# EasyEDA Pro project ProProject_Open Energy Box_2024-07-22.epro, board PCB1
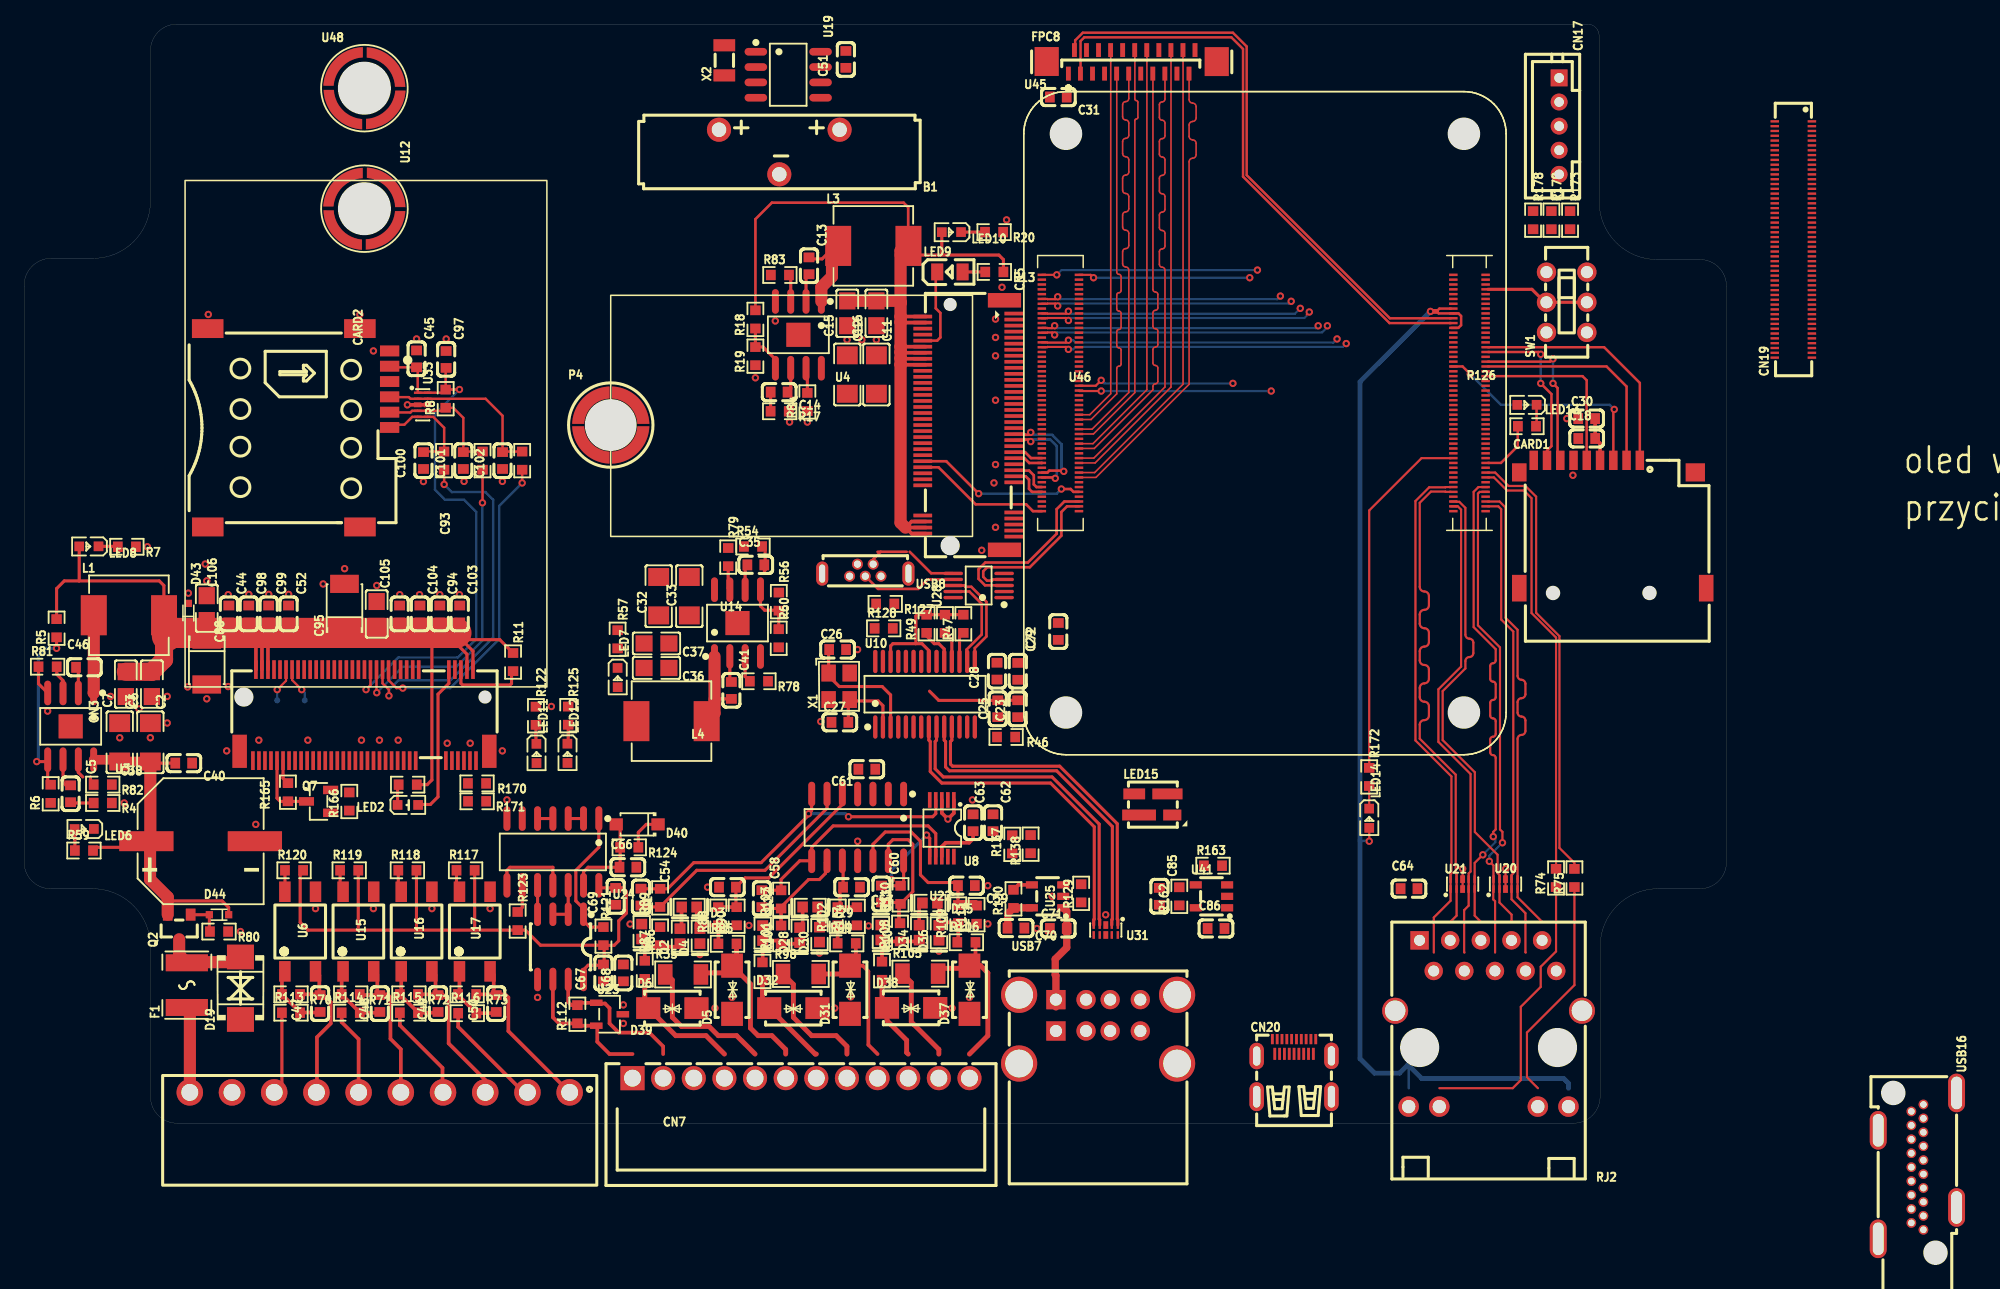
[diagram p12: board, top side]
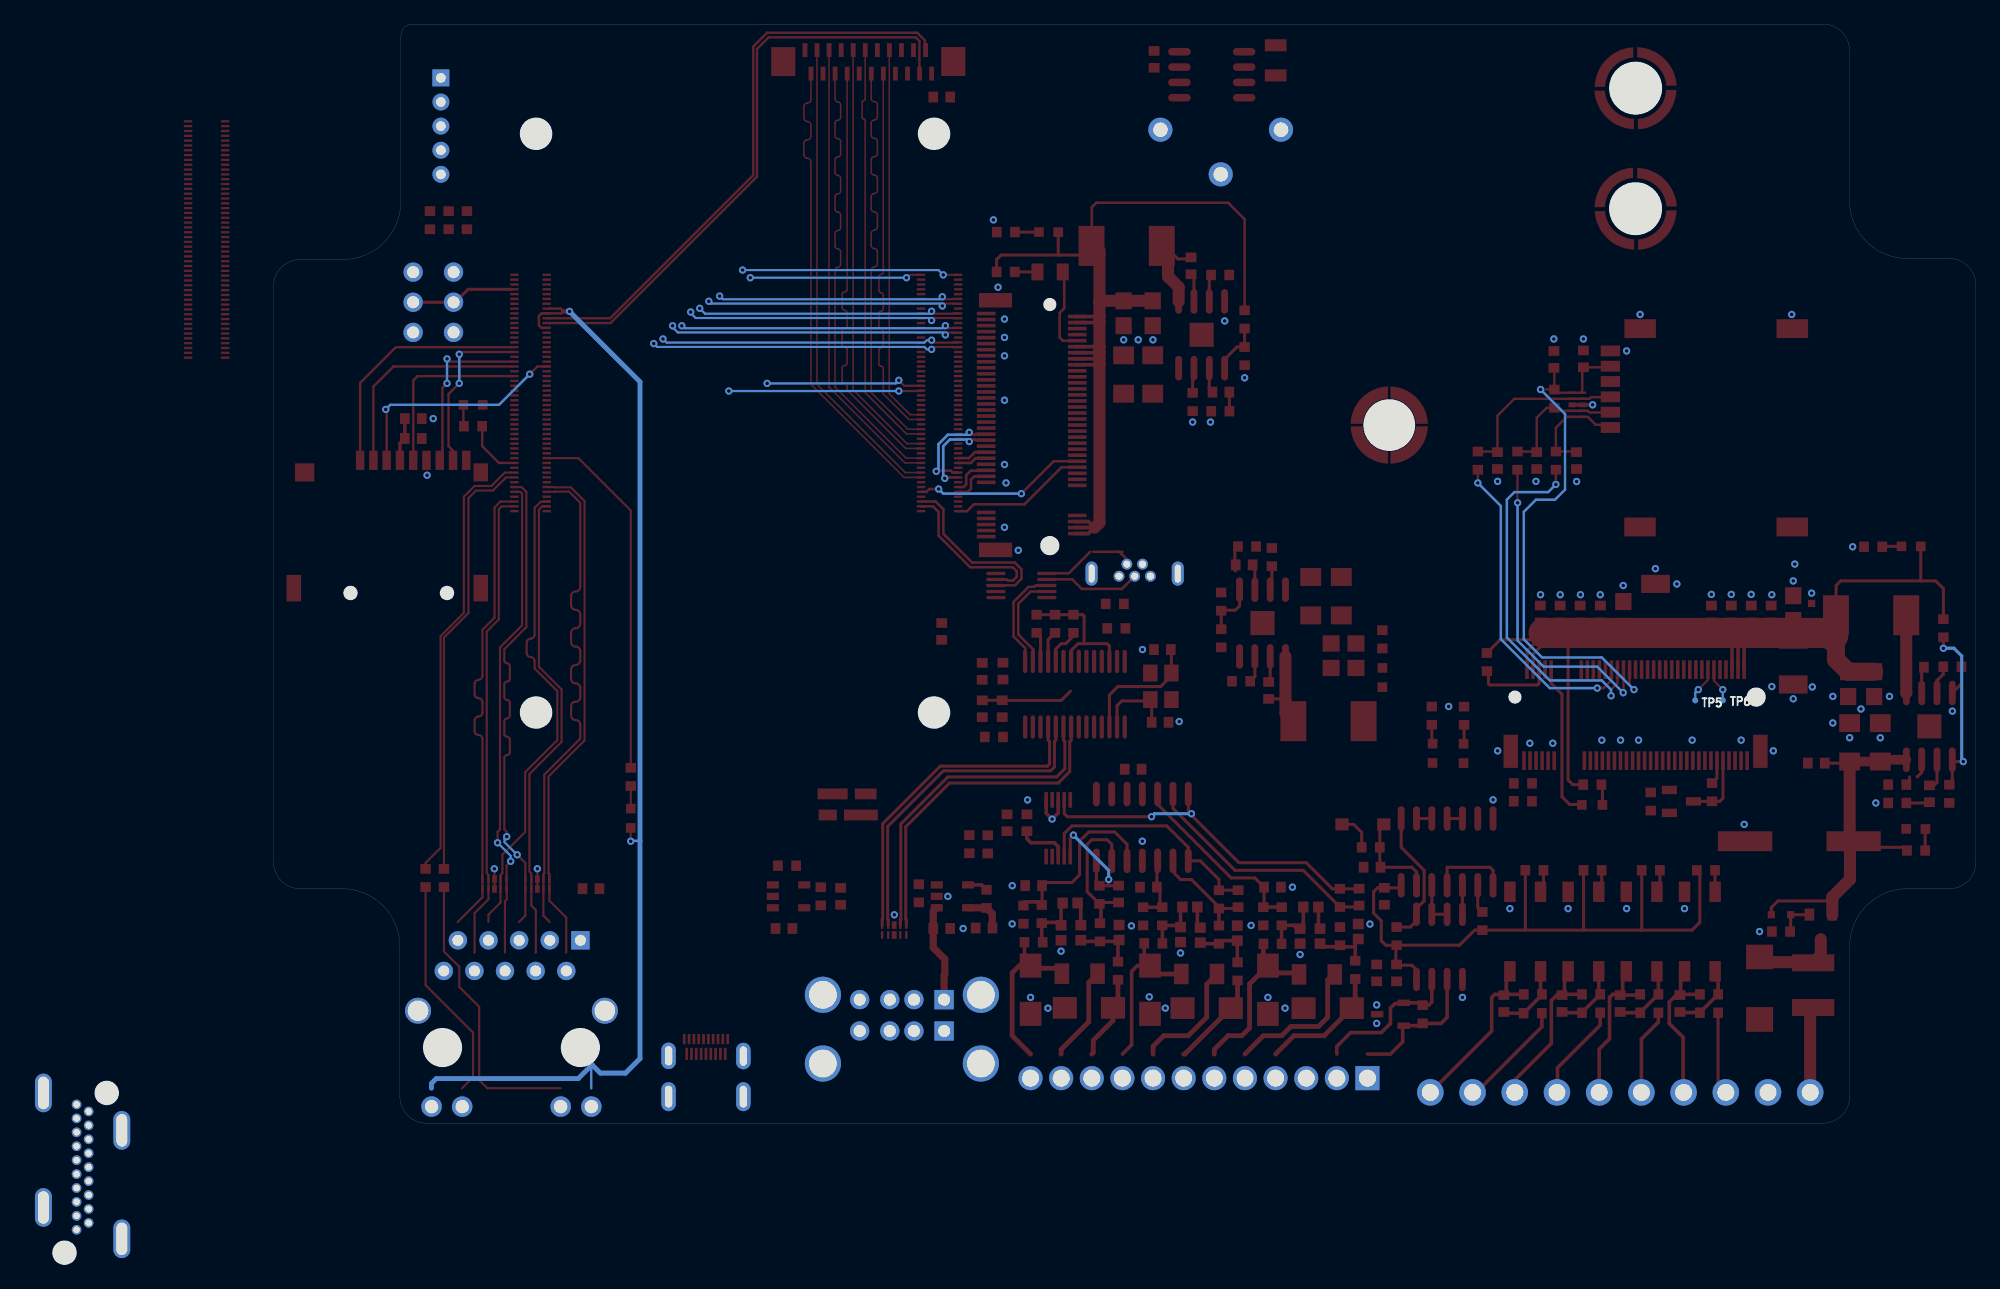
[diagram p13: board, bottom side, seen from below]

Outline 159.51 x 102.91 mm; copper layers: Top Layer, Inner1, Inner2, Bottom Layer. Coordinates in mm from the lower left corner of the outline.
Outline path: 0,81.18 0,33.4 arc(0.64,31.84) 2.2,31.2 5.68,31.2 arc(9.07,29.79) 10.48,26.4 10.48,13.95 arc(11.12,12.4) 12.68,11.75 128.49,11.75 arc(130.04,12.4) 130.69,13.95 130.69,26.4 arc(132.09,29.79) 135.49,31.2 138.96,31.2 arc(140.52,31.84) 141.16,33.4 141.16,81.18 arc(140.52,82.74) 138.96,83.38 135.41,83.38 arc(132.01,84.79) 130.61,88.18 130.61,101.95 arc(130.3,102.64) 129.6,102.91 12.68,102.91 arc(11.12,102.26) 10.48,100.71 10.48,88.18 arc(9.05,84.84) 5.68,83.48 2.2,83.48 arc(0.62,82.79) 0,81.18
Stack: Top Layer 0.035mm 外层铜厚1oz / Dielectric1 0.2104mm 7628 RC49% 8.6mil / Inner1 0.0152mm 内层铜厚 / Dielectric2 1.065mm 1.1mm H/HOZ 含铜 / Inner2 0.0152mm 内层铜厚 / Dielectric3 0.2104mm 7628 RC49% 8.6mil / Bottom Layer 0.035mm 外层铜厚1oz

## Design rules (mm)
net PCIE_CLP_P: PCIE_CLP
net PCIE_CLP_N: PCIE_CLP
net PCIE_R0_P: PCIE_R0_
net PCIE_R0_N: PCIE_R0_
net PCIE_T0_P: PCIE_T0_
net PCIE_T0_N: PCIE_T0_
net USB_GSM_P: USB_GSM_
net USB_GSM_N: USB_GSM_
net ETH_P1_P: DP1
net ETH_P1_N: DP1
net ETH_P0_N: ETH_P0_
net ETH_P0_P: ETH_P0_
net HDMI0_TX2_P: HDMI0_TX2_
net HDMI0_TX2_N: HDMI0_TX2_
net HDMI0_TX1_P: HDMI0_TX1_
net HDMI0_TX1_N: HDMI0_TX1_
net HDMI0_TX0_P: HDMI0_TX0_
net HDMI0_TX0_N: HDMI0_TX0_
net HDMI0_CLK_P: HDMI0_CLK_
net HDMI0_CLK_N: HDMI0_CLK_
net CAM1_D0_N: CAM1_D0_
net CAM1_D0_P: CAM1_D0_
net CAM1_D1_N: CAM1_D1_
net CAM1_D1_P: CAM1_D1_
net CAM1_C_N: CAM1_C_
net CAM1_C_P: CAM1_C_
net CAM1_D2_N: CAM1_D2_
net CAM1_D2_P: CAM1_D2_
net CAM1_D3_N: CAM1_D3_
net CAM1_D3_P: CAM1_D3_
net USB_N: USB_
net USB_P: USB_
net USB2_N: USB2_
net USB2_P: USB2_
net USB1_N: USB1_
net USB1_P: USB1_
net ETH_P3_P: ETH_P3_
net ETH_P3_N: ETH_P3_
net ETH_P2_N: ETH_P2_
net ETH_P2_P: ETH_P2_
net U_P: U_
net U_N: U_
net U2_P: U2_
net U2_N: U2_
template: Custom Config
spacing copperThickness1oz (default): track to track 0.102, other pairs 0.152 to 0.3
spacing copperThickness2oz: track to track 0.203, other pairs 0.152 to 0.3
track width copperThickness1oz (default): min 0.127, default 0.254, max 2.54
track width copperThickness2oz: min 0.203, default 0.254, max 2.54
differential pair differentialPair (default): width min 0.127, default 0.254, max 2.54; gap min 0.178, default 0.178
via viaSize (default): diameter min 0.5, default 0.61, max 10; hole min 0.3, default 0.305, max 6.299

## Placement (name value [footprint] x y rotation side)
B1  CR2032-BS-5-1  [BAT-TH_CR2032-BS-5-1]  62.62 92.3 180 top
C2  10uF  [C1206]  10.47 43.34 270 top
C3  10uF  [C1206]  7.93 43.34 270 top
C5  3.3nF  [C0603]  3.85 39.07 270 top
C6  22uF  [C0805]  10.59 48.17 90 top
C7  22uF  [C0805]  8.44 48.17 90 top
C11  10uF  [C1206]  70.67 73.85 270 top
C12  10uF  [C1206]  68.26 73.85 270 top
C13  100nF  [C0603]  65.08 82.86 270 top
C14  3.3nF  [C0603]  62.61 72.39 180 top
C15  22uF  [C0805]  68.26 78.93 90 top
C16  22uF  [C0805]  70.67 78.93 90 top
C18  100nF  [C0603]  129.57 68.54 0 top
C23  100nF  [C0603]  82.39 46.13 90 top
C25  10uF  [C0603]  80.74 46.13 90 top
C26  20pF  [C0603]  67.46 51.03 0 top
C27  20pF  [C0603]  67.65 45 0 top
C28  100nF  [C0603]  80.68 49.24 90 top
C29  10uF  [C0603]  82.4 49.23 270 top
C30  10uF  [C0603]  129.57 70.19 0 top
C31  100nF  [C0603]  85.76 96.86 180 top
C32  10uF  [C1206]  52.62 55.46 90 top
C33  10uF  [C1206]  55.16 55.46 90 top
C35  3.3nF  [C0603]  60.67 58.06 0 top
C36  22uF  [C0805]  52.44 49.51 180 top
C37  22uF  [C0805]  52.44 51.54 180 top
C38  220uF  [CAP-SMD_BD10.0-L10.3-W10.3-LS11.3-FD]  14.64 35.14 0 top
C40  100nF  [C0603]  13.23 41.62 180 top
C41  100nF  [C0603]  58.65 47.64 270 top
C44  33pF  [C0603]  16.98 53.99 270 top
C45  33pF  [C0603]  32.54 75.14 270 top
C46  100nF  [C0603]  5.01 49.56 0 top
C47  100nF  [C0603]  24.54 21.68 90 top
C48  100nF  [C0603]  29.5 21.68 90 top
C49  100nF  [C0603]  34.32 21.68 90 top
C50  100nF  [C0603]  39.15 21.68 90 top
C51  100nF  [C0603]  68.14 99.98 90 top
C52  100nF  [C0603]  21.93 53.99 270 top
C53  100nF  [C0603]  58.32 31.33 0 top
C54  100nF  [C0603]  51.15 30.51 270 top
C57  100nF  [C0603]  68.61 31.33 180 top
C58  100nF  [C0603]  61.18 30.38 270 top
C59  100nF  [C0603]  78.14 31.46 180 top
C60  100nF  [C0603]  71.09 30.76 270 top
C61  100nF  [C0603]  69.88 41.11 0 top
C62  100nF  [C0603]  80.34 36.67 270 top
C63  10uF  [C0603]  78.69 36.67 270 top
C64  10nF  [C0603]  114.84 31.2 0 top
C66  33pF  [C0603]  50.07 32.98 0 top
C67  100nF  [C0603]  48.04 24.22 90 top
C68  10uF  [C0603]  49.69 24.22 90 top
C69  100nF  [C0603]  49.05 30.57 90 top
C70  10uF  [C0603]  82.24 27.94 180 top
C71  10uF  [C0603]  85.76 27.9 0 top
C72  100nF  [C0603]  85.76 52.54 90 top
C85  10uF  [C0603]  94.14 30.57 270 top
C86  10uF  [C0603]  98.84 27.9 0 top
C88  220uF  [CASE-B_3528]  15.14 50 270 top
C93  33pF  [C0603]  31.14 53.99 270 top
C94  100nF  [C0603]  34.47 53.99 270 top
C95  220uF  [CASE-B_3528]  26.57 54.62 90 top
C97  220nF  [C0603]  34.99 75.1 270 top
C98  10pF  [C0603]  18.63 53.99 270 top
C99  1uF  [C0603]  20.28 53.99 270 top
C100  33pF  [C0603]  33.12 66.71 90 top
C101  33pF  [C0603]  36.42 66.71 90 top
C102  33pF  [C0603]  39.67 66.71 90 top
C103  1uF  [C0603]  36.12 53.99 270 top
C104  10pF  [C0603]  32.82 53.99 270 top
C105  22uF  [C0805]  29.23 53.99 270 top
C106  22uF  [C0805]  15.14 54.47 270 top
CARD1  TF PUSH  [TF-SMD_TF-PUSH]  131.73 61.43 0 top
CARD2  SMC-202-6  [SIM-SMD_SMC-202-6]  22.76 69.43 270 top
CN3  AS0BC21-S40BB-7H  [CONN-SMD_AS0BC21-S30BB-7H]  28.22 45.6 180 top
CN5  APCI0113-P001A  [CONN-SMD_APCI0113-P001A]  78.29 69.65 270 top
CN7  XY2500R-G-3.5-10P  [CONN-TH_XY2500R-G-3.5-10P]  29.49 14.31 180 top
CN10  DB2ERC-2.54-12P-GN  [CONN-TH_12P-P2.54_DIBO_DB2ERC-2.54-12P-GN]  64.42 15.49 0 top
CN17  PH-5A  [CONN-TH_5P-P2.00_PH-5A]  127.29 94.45 270 top
CN19  DF40HC(3.0)-100DS-0.4V(51)  [CONN-SMD_DF40HC-3.0-100DS-0.4V-51]  146.71 85.05 90 top
CN20  HYC23-HDMID19-650  [AUDIO-TH_HYC23-HDMID19-650]  105.31 16.34 0 top
D1  ESD0603E002M05  [D0603-BI]  51.21 27.65 270 top
D2  ESD0603E002M05  [D0603-BI]  54.39 27.27 90 top
D3  ESD0603E002M05  [D0603-BI]  55.15 29.68 180 top
D4  ESD0603E002M05  [D0603-BI]  56.04 27.27 90 top
D5  BV-SMAJ30CA  [SMA_L4.4-W2.6-LS5.0-BI]  58.71 22.82 90 top
D6  BV-SMAJ30CA  [SMA_L4.4-W2.6-LS5.0-BI]  53.75 21.3 0 top
D19  P6SMB27CA/TR13  [SMB_L4.3-W3.6-LS5.4-BI]  17.94 22.95 90 top
D27  ESD0603E002M05  [D0603-BI]  61.25 27.52 270 top
D28  ESD0603E002M05  [D0603-BI]  64.32 27.35 90 top
D29  ESD0603E002M05  [D0603-BI]  65.18 29.68 180 top
D30  ESD0603E002M05  [D0603-BI]  65.95 27.39 90 top
D31  BV-SMAJ30CA  [SMA_L4.4-W2.6-LS5.0-BI]  68.48 22.82 90 top
D32  BV-SMAJ30CA  [SMA_L4.4-W2.6-LS5.0-BI]  63.79 21.3 0 top
D33  ESD0603E002M05  [D0603-BI]  71.05 27.57 270 top
D34  ESD0603E002M05  [D0603-BI]  74.22 27.55 90 top
D35  ESD0603E002M05  [D0603-BI]  75.11 30.01 180 top
D36  ESD0603E002M05  [D0603-BI]  75.86 27.55 90 top
D37  BV-SMAJ30CA  [SMA_L4.4-W2.6-LS5.0-BI]  78.39 22.82 90 top
D38  BV-SMAJ30CA  [SMA_L4.4-W2.6-LS5.0-BI]  73.55 21.32 0 top
D39  PSM712-LF-T7  [SOT-23-3_L3.0-W1.7-P0.95-LS2.9-BR]  48.55 20.79 180 top
D40  1N4148W  [SOD-123F_L2.7-W1.6-LS3.8-RD]  50.83 36.54 180 top
D43  MM5Z4V7  [SOD-523_L1.2-W0.8-LS1.6-FD]  13.62 54.06 270 top
D44  MM5Z4V7  [SOD-523_L1.2-W0.8-LS1.6-FD]  16.16 29.04 0 top
F1  BSMD1812-200-30V  [F1812]  13.49 23.2 90 top
FPC8  AFC11-S22ICC-00  [FPC-SMD_22P-P1.00_AFC11-S22ICC-00]  91.84 99.78 0 top
L1  4.7uH  [IND-SMD_L7.1-W6.6]  8.69 53.88 0 top
L3  4.7uH  [IND-SMD_L7.1-W6.6]  70.42 84.51 0 top
L4  4.7uH  [IND-SMD_L7.1-W6.6]  53.68 45.1 180 top
LED2  -  [LED0603-R-RD]  31.82 38.15 0 top
LED6  19-217/GHC-YR1S2/3T  [LED0603-RD]  4.98 36.16 180 top
LED7  19-217/GHC-YR1S2/3T  [LED0603-RD]  49.21 48.71 270 top
LED8  19-217/GHC-YR1S2/3T  [LED0603-RD]  5.37 59.59 180 top
LED9  KT-0805Y  [LED0805-R-RD]  76.77 82.35 0 top
LED10  19-217/GHC-YR1S2/3T  [LED0603-RD]  76.89 85.66 180 top
LED11  19-217/GHC-YR1S2/3T  [LED0603-RD]  42.48 42.42 270 top
LED12  19-217/GHC-YR1S2/3T  [LED0603-RD]  45.05 42.43 270 top
LED13  19-217/GHC-YR1S2/3T  [LED0603-RD]  124.62 71.33 180 top
LED14  19-217/GHC-YR1S2/3T  [LED0603-RD]  111.54 37.04 270 top
LED15  WS2812E-MINI-X1  [LED-SMD_4P-L3.7-W3.5-P1.75-BR-SK6812MINI]  93.63 38.19 0 top
P4  SMTSO3035CTJ  [SMD_BD5.6-D4.1]  48.65 69.65 0 top
Q2  AO3401A  [SOT-23_L2.9-W1.3-P1.90-LS2.4-BR]  12.86 27.9 90 top
Q7  -  [SOT-23-3_L2.9-W1.3-P1.90-LS2.4-BR]  24.42 38.44 0 top
R4  13K  [R0603]  6.52 38.31 180 top
R5  36.5K  [R0603]  2.69 52.8 90 top
R6  10K  [R0603]  2.2 39.07 90 top
R7  300  [R0603]  8.52 59.56 180 top
R8  15k  [R0603]  34.96 71.84 90 top
R10  1k  [R0603]  31.81 39.83 180 top
R11  100K  [R0603]  40.54 50 270 top
R13  1k  [R0603]  80.45 82.35 180 top
R17  13K  [R0603]  62.65 70.8 180 top
R18  30.9K  [R0603]  60.64 78.42 90 top
R19  10K  [R0603]  60.64 75.37 90 top
R20  300  [R0603]  80.43 85.66 180 top
R35  249kΩ  [R1206]  54.64 24.09 0 top
R46  2.7K  [R0603]  81.43 43.78 180 top
R47  100kΩ  [R0603]  77.88 53.17 90 top
R48  100kΩ  [R0603]  76.36 53.17 90 top
R49  100kΩ  [R0603]  74.83 53.17 90 top
R54  20K  [R0603]  60.44 59.58 0 top
R56  10K  [R0603]  62.58 55.01 270 top
R57  300  [R0603]  49.21 51.89 270 top
R59  2.2kΩ  [R0603]  4.96 34.37 0 top
R60  52.3kΩ  [R0603]  62.57 51.97 270 top
R70  510Ω  [R0603]  22.13 22.44 180 top
R71  510Ω  [R0603]  27.08 22.44 180 top
R72  510Ω  [R0603]  31.91 22.44 180 top
R73  510Ω  [R0603]  36.73 22.44 180 top
R74  510Ω  [R0603]  127.03 32.09 90 top
R75  510Ω  [R0603]  128.56 32.09 90 top
R78  137kΩ  [R0603]  60.93 48.41 180 top
R79  137kΩ  [R0603]  58.38 58.7 270 top
R80  137kΩ  [R0603]  16.16 27.65 180 top
R81  137kΩ  [R0603]  1.95 49.61 0 top
R82  137kΩ  [R0603]  6.52 39.83 180 top
R83  137kΩ  [R0603]  62.67 82.1 0 top
R84  137kΩ  [R0603]  64.95 71.57 90 top
R85  137kΩ  [R0603]  58.32 26.63 0 top
R86  137kΩ  [R0603]  51.47 24.47 270 top
R87  100Ω  [R0603]  52.74 27.27 90 top
R88  100Ω  [R0603]  57.56 28.92 90 top
R89  33kΩ  [R0603]  52.74 30.44 90 top
R90  33kΩ  [R0603]  59.09 28.92 90 top
R98  249kΩ  [R1206]  64.41 24.13 0 top
R99  137kΩ  [R0603]  68.21 26.67 0 top
R100  137kΩ  [R0603]  61.22 24.34 270 top
R101  100Ω  [R0603]  62.77 27.39 90 top
R102  100Ω  [R0603]  67.47 28.92 90 top
R103  33kΩ  [R0603]  62.77 30.31 90 top
R104  33kΩ  [R0603]  69.06 28.91 90 top
R105  249kΩ  [R1206]  74.31 24.15 0 top
R106  137kΩ  [R0603]  78.14 26.76 0 top
R107  137kΩ  [R0603]  71.14 24.4 270 top
R108  100Ω  [R0603]  72.63 27.58 90 top
R109  100Ω  [R0603]  77.46 29.1 90 top
R110  33kΩ  [R0603]  72.68 30.69 90 top
R111  33kΩ  [R0603]  78.98 29.05 90 top
R112  120Ω  [R0603]  45.88 20.79 90 top
R113  4.7kΩ  [R0603]  22.13 20.92 0 top
R114  4.7kΩ  [R0603]  27.08 20.92 0 top
R115  4.7kΩ  [R0603]  31.91 20.92 0 top
R116  4.7kΩ  [R0603]  36.75 20.87 0 top
R117  4.7kΩ  [R0603]  36.61 32.73 0 top
R118  4.7kΩ  [R0603]  31.78 32.73 0 top
R119  4.7kΩ  [R0603]  26.96 32.73 0 top
R120  4.7kΩ  [R0603]  22.38 32.73 0 top
R121  4.7kΩ  [R0603]  48.04 27.27 270 top
R122  300  [R0603]  42.44 45.54 270 top
R123  4.7kΩ  [R0603]  40.93 28.52 270 top
R124  52.3kΩ  [R0603]  50.18 34.63 180 top
R125  300  [R0603]  45.12 45.55 270 top
R126  300  [R0603]  124.62 69.56 0 top
R127  2.7K  [R0603]  71.41 54.82 180 top
R128  2.7K  [R0603]  71.28 52.79 0 top
R129  13K  [R0603]  87.65 30.82 90 top
R130  13K  [R0603]  82.04 30.36 90 top
R137  4.7kΩ  [R0603]  81.94 34.88 90 top
R138  4.7kΩ  [R0603]  83.46 34.89 90 top
R162  13K  [R0603]  95.79 30.57 90 top
R163  13K  [R0603]  98.58 33.11 0 top
R165  NM  [R0603]  21.88 39.2 90 top
R166  100K  [R0603]  26.96 38.43 90 top
R167  22Ω  [R0603]  34.82 66.7 270 top
R168  22Ω  [R0603]  38.01 66.7 270 top
R169  22Ω  [R0603]  41.3 66.7 270 top
R170  0R  [R0603]  37.56 39.94 180 top
R171  0R  [R0603]  37.56 38.45 180 top
R172  300  [R0603]  111.54 40.47 270 top
R173  4.7K  [R0603]  128.19 86.65 270 top
R178  4.7K  [R0603]  125.13 86.65 270 top
R179  4.7K  [R0603]  126.64 86.65 270 top
RJ2  HR911130A  [RJ45-TH_HR911130A]  121.44 20.02 180 top
SW1  MSS22D18G2 125  [SW-TH_SHOU_MSS22D18G2]  127.91 79.84 90 top
TP5  -  [Test-Point-0.5mm]  23.27 46.82 180 bottom
TP6  -  [Test-Point-0.5mm]  20.99 46.82 180 bottom
U3  RT7272BGSP  [SOIC-8_L5.0-W4.0-P1.27-LS6.0-BL-EP2.0]  3.86 44.67 180 top
U4  RT7272BGSP  [SOIC-8_L5.0-W4.0-P1.27-LS6.0-BL-EP2.0]  64.2 77.14 180 top
U6  EL357N(B)(TA)-G  [OPTO-SMD-4_L4.4-W4.1-P2.54-LS7.0-TL]  22.89 27.65 90 top
U8  ADS1015IDGSR  [VSSOP-10_L3.0-W3.0-P0.50-LS4.9-BL]  76.1 36.21 180 top
U10  SL2.2s  [SSOP-28_L9.9-W3.9-P0.64-LS6.0-BL]  74.71 47.33 0 top
U12  SMTSO3025MTJ  [SMD_SMTSO3060CTJ]  28.22 87.6 270 top
U14  RT7272BGSP  [SOIC-8_L5.0-W4.0-P1.27-LS6.0-BL-EP2.0]  59.15 53.23 0 top
U15  EL357N(B)(TA)-G  [OPTO-SMD-4_L4.4-W4.1-P2.54-LS7.0-TL]  27.72 27.65 90 top
U16  EL357N(B)(TA)-G  [OPTO-SMD-4_L4.4-W4.1-P2.54-LS7.0-TL]  32.54 27.65 90 top
U17  EL357N(B)(TA)-G  [OPTO-SMD-4_L4.4-W4.1-P2.54-LS7.0-TL]  37.37 27.65 90 top
U19  XL1307  [SOP-8_L4.9-W3.9-P1.27-LS6.0-BL]  63.36 98.71 270 top
U20  TPD4EUSB30DQAR-N  [DFN-10_L2.5-W1.0-P0.50-BL-A]  122.84 31.58 0 top
U21  TPD4EUSB30DQAR-N  [DFN-10_L2.5-W1.0-P0.50-BL-A]  119.28 31.58 0 top
U22  LM324DT  [SOIC-14_L8.7-W3.9-P1.27-LS6.0-BL]  69.12 36.28 180 top
U23  SP3485EN-L/TR  [SOIC-8_L5.0-W4.0-P1.27-LS6.0-BL]  44.48 26.38 180 top
U24  74HC14D,653  [SOIC-14_L8.7-W3.9-P1.27-LS6.0-BL]  43.85 34.25 180 top
U25  MT9700  [SOT-23-5_L3.0-W1.7-P0.95-LS2.8-BR]  84.87 30.57 0 top
U28  FSUSB42MUX  [MSOP-10_L3.0-W3.0-P0.50-LS5.0-BL]  79.15 56.35 90 top
U31  TPD4EUSB30DQAR-N  [DFN-10_L2.5-W1.0-P0.50-BL-A]  89.69 27.77 180 top
U33  TPD4EUSB30DQAR-N  [DFN-10_L2.5-W1.0-P0.50-BL-A]  33.05 71.33 270 top
U41  MT9700  [SOT-23-5_L3.0-W1.7-P0.95-LS2.8-BR]  98.46 30.57 0 top
U45  CM4 Left  [CM4 LEFT]  97.95 71.21 0 top
U46  CM4 Right  [CM4 RIGHT]  97.95 71.21 0 top
U48  SMTSO3025MTJ  [SMD_SMTSO3060CTJ]  28.22 97.6 0 top
USB7  AF SS-JB17.6  [USB-A-TH_AF-SS-JB17.6]  89.06 19.55 0 top
USB8  MICRO 180°ZB  [MICRO-USB-TH_MICRO-180-ZB]  69.75 57.62 180 top
USB16  HDMI-001C  [HDMI-SMD_HDMI-001C]  157 8.21 270 top
X1  12MHz  [OSC-SMD_4P-L3.2-W2.5-BL]  67.58 47.99 270 top
X2  32.768kHz  [FC-135R_L3.2-W1.5]  58.06 99.91 90 top

## Footprints (pads in the part's own frame, mm; a bottom-side part is the same pattern mirrored in y, then rotated)
AUDIO-TH_HYC23-HDMID19-650
  rect 0.23x0.85 smd: 1(1.8,2.388) 3(1.4,2.388) 5(1,2.388) 7(0.6,2.388) 9(0.2,2.388) 11(-0.2,2.388) 13(-0.6,2.388) 15(-1,2.388) 17(-1.4,2.388) 19(-1.8,2.388)
  rect 0.23x1 smd: 2(1.6,1.163) 4(1.2,1.163) 6(0.8,1.163) 8(0.4,1.163) 10(0,1.163) 12(-0.4,1.163) 14(-0.8,1.163) 16(-1.2,1.163) 18(-1.6,1.163)
  oval 1.2x2.2 hole 0.6x1.6: 20(-3.1,0.983) 20(3.1,1)
  oval 1.2x2.4 hole 0.6x1.8: 20(-3.1,-2.388) 20(3.1,-2.388)
BAT-TH_CR2032-BS-5-1
  round 2 hole 1.2: 1(-5,-1.85) 1(5,-1.85) 2(0,1.85)
C0603
  rect 0.8x0.9 smd: 1(-0.7,0) 2(0.7,0)
C0805
  rect 1.41x1.35 smd: 1(-1.03,0) 2(1.03,0)
C1206
  rect 1.485x1.728 smd: 1(-1.593,0) 2(1.593,0)
CAP-SMD_BD10.0-L10.3-W10.3-LS11.3-FD
  rect 4.5x1.65 smd: 1(-4.5,0) 2(4.5,0)
CASE-B_3528
  rect 1.506x2.376 smd: 1(-1.861,0) 2(1.861,0)
CM4 LEFT
  custom 0.7x0.2 smd: 1(23.243,-8.694) 2(20.563,-8.694) 3(23.243,-8.294) 4(20.563,-8.294) 5(23.243,-7.894) 6(20.563,-7.894) 7(23.243,-7.494) 8(20.563,-7.494) 9(23.243,-7.094) 10(20.563,-7.094) 11(23.243,-6.694) 12(20.563,-6.694) 13(23.243,-6.294) 14(20.563,-6.294) 15(23.243,-5.894) 16(20.563,-5.894) 17(23.243,-5.494) 18(20.563,-5.494) 19(23.243,-5.094) 20(20.563,-5.094) 21(23.243,-4.694) 22(20.563,-4.694) 23(23.243,-4.294) 24(20.563,-4.294) 25(23.243,-3.894) 26(20.563,-3.894) 27(23.243,-3.494) 28(20.563,-3.494) 29(23.243,-3.094) 30(20.563,-3.094) 31(23.243,-2.694) 32(20.563,-2.694) 33(23.243,-2.294) 34(20.563,-2.294) 35(23.243,-1.894) 36(20.563,-1.894) 37(23.243,-1.494) 38(20.563,-1.494) 39(23.243,-1.094) 40(20.563,-1.094) 41(23.243,-0.694) 42(20.563,-0.694) 43(23.243,-0.294) 44(20.563,-0.294) 45(23.243,0.106) 46(20.563,0.106) 47(23.243,0.506) 48(20.563,0.506) 49(23.243,0.906) 50(20.563,0.906) 51(23.243,1.306) 52(20.563,1.306) 53(23.243,1.706) 54(20.563,1.706) 55(23.243,2.106) 56(20.563,2.106) 57(23.243,2.506) 58(20.563,2.506) 59(23.243,2.906) 60(20.563,2.906) 61(23.243,3.306) 62(20.563,3.306) 63(23.243,3.706) 64(20.563,3.706) 65(23.243,4.106) 66(20.563,4.106) 67(23.243,4.506) 68(20.563,4.506) 69(23.243,4.906) 70(20.563,4.906) 71(23.243,5.306) 72(20.563,5.306) 73(23.243,5.706) 74(20.563,5.706) 75(23.243,6.106) 76(20.563,6.106) 77(23.243,6.506) 78(20.563,6.506) 79(23.243,6.906) 80(20.563,6.906) 81(23.243,7.306) 82(20.563,7.306) 83(23.243,7.706) 84(20.563,7.706) 85(23.243,8.106) 86(20.563,8.106) 87(23.243,8.506) 88(20.563,8.506) 89(23.243,8.906) 90(20.563,8.906) 91(23.243,9.306) 92(20.563,9.306) 93(23.243,9.706) 94(20.563,9.706) 95(23.243,10.106) 96(20.563,10.106) 97(23.243,10.506) 98(20.563,10.506) 99(23.243,10.906) 100(20.563,10.906)
CM4 RIGHT
  custom 0.7x0.2 smd: 101(-10.477,-8.694) 102(-13.557,-8.694) 103(-10.477,-8.294) 104(-13.557,-8.294) 105(-10.477,-7.894) 106(-13.557,-7.894) 107(-10.477,-7.494) 108(-13.557,-7.494) 109(-10.477,-7.094) 110(-13.557,-7.094) 111(-10.477,-6.694) 112(-13.557,-6.694) 113(-10.477,-6.294) 114(-13.557,-6.294) 115(-10.477,-5.894) 116(-13.557,-5.894) 117(-10.477,-5.494) 118(-13.557,-5.494) 119(-10.477,-5.094) 120(-13.557,-5.094) 121(-10.477,-4.694) 122(-13.557,-4.694) 123(-10.477,-4.294) 124(-13.557,-4.294) 125(-10.477,-3.894) 126(-13.557,-3.894) 127(-10.477,-3.494) 128(-13.557,-3.494) 129(-10.477,-3.094) 130(-13.557,-3.094) 131(-10.477,-2.694) 132(-13.557,-2.694) 133(-10.477,-2.294) 134(-13.557,-2.294) 135(-10.477,-1.894) 136(-13.557,-1.894) 137(-10.477,-1.494) 138(-13.557,-1.494) 139(-10.477,-1.094) 140(-13.557,-1.094) 141(-10.477,-0.694) 142(-13.557,-0.694) 143(-10.477,-0.294) 144(-13.557,-0.294) 145(-10.477,0.106) 146(-13.557,0.106) 147(-10.477,0.506) 148(-13.557,0.506) 149(-10.477,0.906) 150(-13.557,0.906) 151(-10.477,1.306) 152(-13.557,1.306) 153(-10.477,1.706) 154(-13.557,1.706) 155(-10.477,2.106) 156(-13.557,2.106) 157(-10.477,2.506) 158(-13.557,2.506) 159(-10.477,2.906) 160(-13.557,2.906) 161(-10.477,3.306) 162(-13.557,3.306) 163(-10.477,3.706) 164(-13.557,3.706) 165(-10.477,4.106) 166(-13.557,4.106) 167(-10.477,4.506) 168(-13.557,4.506) 169(-10.477,4.906) 170(-13.557,4.906) 171(-10.477,5.306) 172(-13.557,5.306) 173(-10.477,5.706) 174(-13.557,5.706) 175(-10.477,6.106) 176(-13.557,6.106) 177(-10.477,6.506) 178(-13.557,6.506) 179(-10.477,6.906) 180(-13.557,6.906) 181(-10.477,7.306) 182(-13.557,7.306) 183(-10.477,7.706) 184(-13.557,7.706) 185(-10.477,8.106) 186(-13.557,8.106) 187(-10.477,8.506) 188(-13.557,8.506) 189(-10.477,8.906) 190(-13.557,8.906) 191(-10.477,9.306) 192(-13.557,9.306) 193(-10.477,9.706) 194(-13.557,9.706) 195(-10.477,10.106) 196(-13.557,10.106) 197(-10.477,10.506) 198(-13.557,10.506) 199(-10.477,10.906) 200(-13.557,10.906)
CONN-SMD_APCI0113-P001A
  rect 0.3x1.55 smd: 1(-9.25,3.775) 2(-9,-3.775) 3(-8.75,3.775) 4(-8.5,-3.775) 5(-8.25,3.775) 6(-8,-3.775) 7(-7.75,3.775) 8(-7.5,-3.775) 9(-7.25,3.775) 10(-7,-3.775) 11(-6.75,3.775) 12(-6.5,-3.775) 13(-6.25,3.775) 14(-6,-3.775) 15(-5.75,3.775) 16(-5.5,-3.775) 17(-5.25,3.775) 18(-5,-3.775) 19(-4.75,3.775) 20(-4.5,-3.775) 21(-4.25,3.775) 22(-4,-3.775) 23(-3.75,3.775) 24(-3.5,-3.775) 25(-3.25,3.775) 26(-3,-3.775) 27(-2.75,3.775) 28(-2.5,-3.775) 29(-2.25,3.775) 30(-2,-3.775) 31(-1.75,3.775) 32(-1.5,-3.775) 33(-1.25,3.775) 34(-1,-3.775) 35(-0.75,3.775) 36(-0.5,-3.775) 37(-0.25,3.775) 38(0,-3.775) 39(0.25,3.775) 40(0.5,-3.775) 41(0.75,3.775) 42(1,-3.775) 43(1.25,3.775) 44(1.5,-3.775) 45(1.75,3.775) 46(2,-3.775) 47(2.25,3.775) 48(2.5,-3.775) 49(2.75,3.775) 50(3,-3.775) 51(3.25,3.775) 52(3.5,-3.775) 53(3.75,3.775) 54(4,-3.775) 55(4.25,3.775) 56(4.5,-3.775) 57(4.75,3.775) 58(5,-3.775) 67(7.25,3.775) 68(7.5,-3.775) 69(7.75,3.775) 70(8,-3.775) 71(8.25,3.775) 72(8.5,-3.775) 73(8.75,3.775) 74(9,-3.775) 75(9.25,3.775)
  rect 1.2x2.75 smd: 76(-10.35,3) 77(10.35,3)
CONN-SMD_AS0BC21-S30BB-7H
  rect 0.3x1.55 smd: 1(-9.25,3.775) 2(-9,-3.775) 3(-8.75,3.775) 4(-8.5,-3.775) 5(-8.25,3.775) 6(-8,-3.775) 7(-7.75,3.775) 8(-7.5,-3.775) 9(-7.25,3.775) 10(-7,-3.775) 11(-6.75,3.775) 20(-4.5,-3.775) 21(-4.25,3.775) 22(-4,-3.775) 23(-3.75,3.775) 24(-3.5,-3.775) 25(-3.25,3.775) 26(-3,-3.775) 27(-2.75,3.775) 28(-2.5,-3.775) 29(-2.25,3.775) 30(-2,-3.775) 31(-1.75,3.775) 32(-1.5,-3.775) 33(-1.25,3.775) 34(-1,-3.775) 35(-0.75,3.775) 36(-0.5,-3.775) 37(-0.25,3.775) 38(0,-3.775) 39(0.25,3.775) 40(0.5,-3.775) 41(0.75,3.775) 42(1,-3.775) 43(1.25,3.775) 44(1.5,-3.775) 45(1.75,3.775) 46(2,-3.775) 47(2.25,3.775) 48(2.5,-3.775) 49(2.75,3.775) 50(3,-3.775) 51(3.25,3.775) 52(3.5,-3.775) 53(3.75,3.775) 54(4,-3.775) 55(4.25,3.775) 56(4.5,-3.775) 57(4.75,3.775) 58(5,-3.775) 59(5.25,3.775) 60(5.5,-3.775) 61(5.75,3.775) 62(6,-3.775) 63(6.25,3.775) 64(6.5,-3.775) 65(6.75,3.775) 66(7,-3.775) 67(7.25,3.775) 68(7.5,-3.775) 69(7.75,3.775) 70(8,-3.775) 71(8.25,3.775) 72(8.5,-3.775) 73(8.75,3.775) 74(9,-3.775) 75(9.25,3.775)
  rect 1.2x2.75 smd: 76(10.35,3) 77(-10.35,3)
CONN-SMD_DF40HC-3.0-100DS-0.4V-51
  rect 0.19x0.7 smd: 1(9.8,-1.54) 2(9.4,-1.54) 3(9,-1.54) 4(8.6,-1.54) 5(8.2,-1.54) 6(7.8,-1.54) 7(7.4,-1.54) 8(7,-1.54) 9(6.6,-1.54) 10(6.2,-1.54) 11(5.8,-1.54) 12(5.4,-1.54) 13(5,-1.54) 14(4.6,-1.54) 15(4.2,-1.54) 16(3.8,-1.54) 17(3.4,-1.54) 18(3,-1.54) 19(2.6,-1.54) 20(2.2,-1.54) 21(1.8,-1.54) 22(1.4,-1.54) 23(1,-1.54) 24(0.6,-1.54) 25(0.2,-1.54) 26(-0.2,-1.54) 27(-0.6,-1.54) 28(-1,-1.54) 29(-1.4,-1.54) 30(-1.8,-1.54) 31(-2.2,-1.54) 32(-2.6,-1.54) 33(-3,-1.54) 34(-3.4,-1.54) 35(-3.8,-1.54) 36(-4.2,-1.54) 37(-4.6,-1.54) 38(-5,-1.54) 39(-5.4,-1.54) 40(-5.8,-1.54) 41(-6.2,-1.54) 42(-6.6,-1.54) 43(-7,-1.54) 44(-7.4,-1.54) 45(-7.8,-1.54) 46(-8.2,-1.54) 47(-8.6,-1.54) 48(-9,-1.54) 49(-9.4,-1.54) 50(-9.8,-1.54) 51(-9.8,1.54) 52(-9.4,1.54) 53(-9,1.54) 54(-8.6,1.54) 55(-8.2,1.54) 56(-7.8,1.54) 57(-7.4,1.54) 58(-7,1.54) 59(-6.6,1.54) 60(-6.2,1.54) 61(-5.8,1.54) 62(-5.4,1.54) 63(-5,1.54) 64(-4.6,1.54) 65(-4.2,1.54) 66(-3.8,1.54) 67(-3.4,1.54) 68(-3,1.54) 69(-2.6,1.54) 70(-2.2,1.54) 71(-1.8,1.54) 72(-1.4,1.54) 73(-1,1.54) 74(-0.6,1.54) 75(-0.2,1.54) 76(0.2,1.54) 77(0.6,1.54) 78(1,1.54) 79(1.4,1.54) 80(1.8,1.54) 81(2.2,1.54) 82(2.6,1.54) 83(3,1.54) 84(3.4,1.54) 85(3.8,1.54) 86(4.2,1.54) 87(4.6,1.54) 88(5,1.54) 89(5.4,1.54) 90(5.8,1.54) 91(6.2,1.54) 92(6.6,1.54) 93(7,1.54) 94(7.4,1.54) 95(7.8,1.54) 96(8.2,1.54) 97(8.6,1.54) 98(9,1.54) 99(9.4,1.54) 100(9.8,1.54)
CONN-TH_5P-P2.00_PH-5A
  rect 1.4x1.4 hole 0.8: 1(-4,0)
  round 1.4 hole 0.8: 2(-2,0) 3(0,0) 4(2,0) 5(4,0)
CONN-TH_12P-P2.54_DIBO_DB2ERC-2.54-12P-GN
  rect 2x2 hole 1.4: 1(-13.97,0)
  round 2 hole 1.4: 2(-11.43,0) 3(-8.89,0) 4(-6.35,0) 5(-3.81,0) 6(-1.27,0) 7(1.27,0) 8(3.81,0) 9(6.35,0) 10(8.89,0) 11(11.43,0) 12(13.97,0)
CONN-TH_XY2500R-G-3.5-10P
  round 2.2 hole 1.4: 1(-15.75,0) 2(-12.25,0) 3(-8.75,0) 4(-5.25,0) 5(-1.75,0) 6(1.75,0) 7(5.25,0) 8(8.75,0) 9(12.25,0) 10(15.75,0)
D0603-BI
  rect 0.873x0.907 smd: 1(-0.622,0) 2(0.622,0)
DFN-10_L2.5-W1.0-P0.50-BL-A
  rect 0.2x0.633 smd: 1(-1,-0.411) 2(-0.5,-0.411) 4(0.5,-0.411) 5(1,-0.411) 6(1,0.411) 7(0.5,0.411) 9(-0.5,0.411) 10(-1,0.411)
  rect 0.4x0.633 smd: 3(0,-0.411) 8(0,0.411)
F1812
  rect 1.407x3.499 smd: 1(-1.853,0) 2(1.853,0)
FC-135R_L3.2-W1.5
  rect 1x1.8 smd: 1(-1.25,0) 2(1.25,0)
FPC-SMD_22P-P1.00_AFC11-S22ICC-00
  rect 0.4x1.15 smd: 1(-5.25,-0.975) 2(-4.75,0.975) 3(-4.25,-0.975) 4(-3.75,0.975) 5(-3.25,-0.975) 6(-2.75,0.975) 7(-2.25,-0.975) 8(-1.75,0.975) 9(-1.25,-0.975) 10(-0.75,0.975) 11(-0.25,-0.975) 12(0.25,0.975) 13(0.75,-0.975) 14(1.25,0.975) 15(1.75,-0.975) 16(2.25,0.975) 17(2.75,-0.975) 18(3.25,0.975) 19(3.75,-0.975) 20(4.25,0.975) 21(4.75,-0.975) 22(5.25,0.975)
  rect 2x2.4 smd: 23(7.05,0.021) 24(-7.05,0.029)
HDMI-SMD_HDMI-001C
  round 0.8 hole 0.55: 1(5.3,0.5) 2(4.731,-0.5) 3(4.145,0.5) 4(3.575,-0.5) 5(2.99,0.5) 6(2.419,-0.5) 7(1.835,0.5) 8(1.264,-0.5) 9(0.68,0.5) 10(0.107,-0.5) 11(-0.475,0.5) 12(-1.049,-0.5) 13(-1.63,0.5) 14(-2.205,-0.5) 15(-2.785,0.5) 16(-3.361,-0.5) 17(-3.94,0.5) 18(-4.517,-0.5) 19(-5.095,0.5)
  oval 3.2x1.4 hole 2.7x0.9: 20(-6.05,3.25) 20(-2.95,-3.25) 20(3.45,3.25) 20(6.05,-3.25)
IND-SMD_L7.1-W6.6
  rect 2.15x3.32 smd: 1(-2.913,0) 2(2.913,0)
LED0603-R-RD
  rect 0.8x0.8 smd: 1(0.851,0) 2(-0.851,0)
LED0603-RD
  rect 0.8x0.8 smd: 1(-0.799,-0.004) 2(0.799,0.004)
LED0805-R-RD
  rect 1x1.399 smd: 1(1.05,0) 2(-1.05,0)
LED-SMD_4P-L3.7-W3.5-P1.75-BR-SK6812MINI
  rect 1.5x0.9 smd: 1(1.575,-0.875)
  rect 2.5x0.9 smd: 2(1.175,0.875)
  rect 1.8x0.9 smd: 3(-1.575,0.875)
  rect 2.8x0.9 smd: 4(-1.175,-0.875)
MICRO-USB-TH_MICRO-180-ZB
  round 0.9 hole 0.6: 1(-1.3,0.5) 2(-0.65,-0.5) 3(0,0.5) 4(0.65,-0.5) 5(1.3,0.5)
  oval 1x2 hole 0.5x1.5: 6(-3.575,0.28) 6(3.575,0.28)
MSOP-10_L3.0-W3.0-P0.50-LS5.0-BL
  oval 0.28x1.62 smd: 1(-1,-2.11) 2(-0.5,-2.11) 3(0,-2.11) 4(0.5,-2.11) 5(1,-2.11) 6(1,2.11) 7(0.5,2.11) 8(0,2.11) 9(-0.5,2.11) 10(-1,2.11)
OPTO-SMD-4_L4.4-W4.1-P2.54-LS7.0-TL
  rect 1.7x0.95 smd: 1(-3.3,1.27) 2(-3.3,-1.27) 3(3.3,-1.27) 4(3.3,1.27)
OSC-SMD_4P-L3.2-W2.5-BL
  rect 1.4x1.2 smd: 1(-1.1,-0.875) 2(1.1,-0.875) 3(1.1,0.875) 4(-1.1,0.875)
R0603
  rect 0.806x0.864 smd: 1(-0.753,0) 2(0.753,0)
R1206
  rect 1.208x1.701 smd: 1(-1.479,0) 2(1.479,0)
RJ45-TH_HR911130A
  round 1.7 hole 1.1: 11(6.625,6.895) 12(4.085,6.895) 13(-4.085,6.895) 14(-6.625,6.895)
  rect 1.524x1.524 hole 0.91: P1(5.72,-6.895)
  round 1.524 hole 0.91: P2(4.549,-4.355) P3(3.18,-6.895) P4(2.009,-4.355) P5(0.64,-6.895) P6(-0.531,-4.355) P7(-1.9,-6.895) P8(-3.071,-4.355) P9(-4.44,-6.895) P10(-5.611,-4.355)
  round 2.159 hole 1.7: SHIELD0(-7.745,-1.056) SHIELD1(7.745,-1.056)
SIM-SMD_SMC-202-6
  rect 1.56x2.61 smd: 7(-8.225,5.075) 8(-8.225,-7.543) 9(8.225,-7.537) 10(8.225,5.087)
  rect 0.9x1.6 smd: C1(-5.105,7.543) C2(-2.565,7.543) C3(-0.025,7.543) C5(-6.375,7.543) C6(-3.835,7.543) C7(-1.295,7.543)
SMA_L4.4-W2.6-LS5.0-BI
  rect 2x1.8 smd: 1(-2,0) 2(2,0)
SMB_L4.3-W3.6-LS5.4-BI
  rect 2.047x2.241 smd: 1(-2.591,0) 2(2.591,0)
SMD_BD5.6-D4.1
  custom 3.1x3.1 smd: 1(-2.102,1.65) 2(1.65,2.102) 3(2.102,-1.65) 4(-1.65,-2.102)
SMD_SMTSO3060CTJ
  custom 3.197x3.278 smd: 1(1.79,2.34)
  custom 3.279x3.197 smd: 2(1.768,-2.386) 4(-1.769,2.386)
  custom 3.197x3.279 smd: 3(-1.79,-2.369)
SOD-123F_L2.7-W1.6-LS3.8-RD
  rect 1.1x1 smd: 1(-1.735,0) 2(1.735,0)
SOD-523_L1.2-W0.8-LS1.6-FD
  rect 0.6x0.6 smd: 1(-0.8,0) 2(0.8,0)
SOIC-8_L5.0-W4.0-P1.27-LS6.0-BL
  oval 0.569x1.95 smd: 1(-1.905,-2.705) 2(-0.635,-2.705) 3(0.635,-2.705) 4(1.905,-2.705) 5(1.905,2.705) 6(0.635,2.705) 7(-0.635,2.705) 8(-1.905,2.705)
SOIC-8_L5.0-W4.0-P1.27-LS6.0-BL-EP2.0
  oval 0.574x2.038 smd: 1(-1.905,-2.769) 2(-0.635,-2.769) 3(0.635,-2.769) 4(1.905,-2.769) 5(1.905,2.769) 6(0.635,2.769) 7(-0.635,2.769) 8(-1.905,2.769)
  rect 2x2 smd: 9(0,0)
SOIC-14_L8.7-W3.9-P1.27-LS6.0-BL
  oval 0.574x2.038 smd: 1(-3.81,-2.769) 2(-2.54,-2.769) 3(-1.27,-2.769) 4(0,-2.769) 5(1.27,-2.769) 6(2.54,-2.769) 7(3.81,-2.769) 8(3.81,2.769) 9(2.54,2.769) 10(1.27,2.769) 11(0,2.769) 12(-1.27,2.769) 13(-2.54,2.769) 14(-3.81,2.769)
SOP-8_L4.9-W3.9-P1.27-LS6.0-BL
  oval 0.63x1.865 smd: 1(-1.905,-2.683) 2(-0.635,-2.683) 3(0.635,-2.683) 4(1.905,-2.683) 5(1.905,2.683) 6(0.635,2.683) 7(-0.635,2.683) 8(-1.905,2.683)
SOT-23-3_L2.9-W1.3-P1.90-LS2.4-BR
  rect 1.25x0.7 smd: 1(1,-0.95) 2(1,0.95) 3(-1,0)
SOT-23-3_L3.0-W1.7-P0.95-LS2.9-BR
  rect 1.038x0.532 smd: 1(1.101,-0.95) 2(1.101,0.95) 3(-1.101,0)
SOT-23-5_L3.0-W1.7-P0.95-LS2.8-BR
  rect 1x0.6 smd: 1(1.3,-0.95) 2(1.3,0) 3(1.3,0.95) 4(-1.3,0.95) 5(-1.3,-0.95)
SOT-23_L2.9-W1.3-P1.90-LS2.4-BR
  rect 1x0.8 smd: 1(1.15,-0.95) 2(1.15,0.95) 3(-1.15,0)
SSOP-28_L9.9-W3.9-P0.64-LS6.0-BL
  oval 0.355x1.935 smd: 1(-4.128,-2.717) 2(-3.493,-2.717) 3(-2.857,-2.717) 4(-2.223,-2.717) 5(-1.587,-2.717) 6(-0.953,-2.717) 7(-0.318,-2.717) 8(0.318,-2.717) 9(0.953,-2.717) 10(1.587,-2.717) 11(2.223,-2.717) 12(2.857,-2.717) 13(3.493,-2.717) 14(4.128,-2.717) 15(4.128,2.717) 16(3.493,2.717) 17(2.857,2.717) 18(2.223,2.717) 19(1.587,2.717) 20(0.953,2.717) 21(0.318,2.717) 22(-0.318,2.717) 23(-0.953,2.717) 24(-1.587,2.717) 25(-2.223,2.717) 26(-2.857,2.717) 27(-3.493,2.717) 28(-4.128,2.717)
SW-TH_SHOU_MSS22D18G2
  round 1.6 hole 1: 1(-2.5,1.675) 2(0,1.675) 3(2.5,1.675) 4(-2.5,-1.675) 5(0,-1.675) 6(2.5,-1.675)
Test-Point-0.5mm
  round 0.5 smd: 1(0,0)
TF-SMD_TF-PUSH
  rect 0.7x1.6 smd: 1(2.25,5.3) 2(1.15,5.3) 3(0.05,5.3) 4(-1.05,5.3) 5(-2.15,5.3) 6(-3.25,5.3) 7(-4.35,5.3) 8(-5.45,5.3) CD(-6.55,5.3)
  rect 1.2x1.5 smd: 10(-7.75,4.3)
  rect 1.2x2.2 smd: 11(-7.75,-5.3) 12(7.75,-5.3)
  rect 1.6x1.5 smd: 13(6.85,4.3)
USB-A-TH_AF-SS-JB17.6
  rect 1.6x1.6 hole 1: 1(-3.5,2.45) 5(-3.5,-0.15)
  round 1.6 hole 1: 2(-1,2.45) 3(1,2.45) 4(3.5,2.45) 6(-1,-0.15) 7(1,-0.15) 8(3.5,-0.15)
  round 3 hole 2.3: 9(-6.55,2.85) 10(6.55,2.85) 11(-6.55,-2.85) 12(6.55,-2.85)
VSSOP-10_L3.0-W3.0-P0.50-LS4.9-BL
  rect 0.3x1.3 smd: 1(-1,-2.35) 2(-0.5,-2.35) 3(0,-2.35) 4(0.5,-2.35) 5(1,-2.35) 6(1,2.35) 7(0.5,2.35) 8(0,2.35) 9(-0.5,2.35) 10(-1,2.35)

## Nets
As in the schematic, except:
ANALOG_INT: U8.2
CAMERA_GPIO: FPC8.6 U45.97
PI_NLED_ACTIVITY: R126.1 U45.21

Pads without a net: CARD1 CD; CARD2 C6; CN3 1 8 20 21 22 23 24 25 26 28 29 31 35 37 38 40 41 42 43 44 46 47 48 49 50 52 53 54 55 56 58 59 60 61 63 66 68 69 75; CN5 1 5 6 7 8 11 13 17 19 20 21 22 23 24 25 26 28 29 30 31 32 34 35 36 37 38 40 42 44 46 48 54 56 58 67 68 69 75; CN19 1 2 3 4 5 6 7 8 9 10 11 12 13 14 15 16 17 18 19 20 21 22 23 24 25 26 27 28 29 30 31 32 33 34 35 36 37 38 39 40 41 42 43 44 45 46 47 48 49 50 51 52 53 54 55 56 57 58 59 60 61 62 63 64 65 66 67 68 69 70 71 72 73 74 75 76 77 78 79 80 81 82 83 84 85 86 87 88 89 90 91 92 93 94 95 96 97 98 99 100; CN20 2; FPC8 5; LED15 1 2 3 4; SW1 3 6; U8 5; U10 6 7 22 23 24 25 27; U12 2 3 4; U19 7; U22 1 2 3; U45 16 18 19 20 25 27 29 35 36 37 38 41 45 49 51 64 68 70 72 73 76 88 89 90 91 92 94 95 96 99 100; U46 104 106 111 128 130 134 136 140 142 143 145 146 147 148 149 152 154 157 158 159 160 163 164 165 166 169 171 175 177 181 183 187 189 193 194 195 196; U48 2 3 4; USB8 4; USB16 14

## Via types
v1: diameter 0.61, hole 0.305, Top Layer to Bottom Layer, 157 vias

## Routing (per net, layer and track width the routed paths; a pad name or vN(x,y) marks a point on that pad's centre or on a via; arc(x,y) is an arc through that point)
3.3V-SSD: length 84.2
  Top Layer w0.213: L3.2 73.31,84.53 73.31,87.72 72.93,88.1 62.01,88.1 60.64,86.73 R18.2
  Top Layer w0.254: 76.02,83.75 80.83,83.75 81.2,83.38 R13.1 ; 76.02,83.75 74.09,83.75 L3.2 ; 76.02,83.75 76.1,83.83 LED10.2 ; 73.08,84.51 73.84,83.75 72.44,83.75
  Top Layer w0.3: 72.7,75.2 72.75,75.15 74.77,75.15 ; 73.09,61.15 73.59,61.65 74.77,61.65 ; 73.09,61.15 74.77,61.15 ; 73.09,61.15 73.59,60.65 74.77,60.65 ; 73.09,61.15 73.08,61.15 ; 72.7,78.2 72.75,78.15 74.77,78.15 ; 72.7,78.65 72.71,78.65 74.77,78.65 ; 74.77,76.15 72.71,76.15 72.7,76.15 ; 72.7,75.7 72.75,75.65 74.77,75.65 ; 74.77,74.65 72.72,74.65 72.7,74.67
  Top Layer w1: 72.68,79.84 72.56,79.96 C16.2 C15.2 ; 72.68,79.84 72.68,84.11 73.08,84.51 ; 72.68,79.84 72.7,79.81 72.68,79.79 72.68,78.68 72.7,78.65 72.68,78.62 72.68,78.23 72.7,78.2 72.68,78.17 72.68,76.18 72.7,76.15 72.68,76.12 72.68,75.73 72.7,75.7 72.68,75.67 72.68,75.22 72.7,75.2 72.68,75.17 72.68,74.7 72.7,74.67 72.68,74.64 72.68,61.56 73.08,61.15
24V-IN: length 7.1
  Top Layer w1: F1.1 13.75,21.1 13.75,14.32 CN7.10
+1.8V: length 2
  Top Layer w0.254: CN3.65 21.47,40.36 R165.2
+3.3V: length 164.3
  Top Layer w0.178: LED14.2 v1(111.54,35.14)
  Top Layer w0.2: 118.31,77.71 118.93,77.71 119.16,77.94 119.16,78.7 118.95,78.91 U45.84 117.29,78.91 117.13,79.08 117.36,79.31 118.31,79.31
  Top Layer w0.254: 48.16,26.51 48.1,26.45 48.1,24.85 ; 48.16,26.51 42.82,26.51 41.57,27.76 37.42,27.76 ; 48.16,26.51 48.17,26.5 48.93,26.5 49.31,26.88 49.31,28.54 49.94,29.17 49.94,30.95 49.62,31.27 C69.2 47.87,31.27 U24.14 ; 37.42,27.76 37.36,27.82 R117.2 ; 37.42,27.76 32.6,27.76 ; 32.6,27.76 32.54,27.83 R118.2 ; 32.6,27.76 27.71,27.76 ; U23.8 46.39,24.47 46.77,24.85 48.1,24.85 ; 23.14,32.6 22.89,32.35 22.89,28.41 23.54,27.76 27.71,27.76 ; R119.2 27.71,27.77 27.71,27.76 ; 48.1,24.85 48.16,24.92
  Top Layer w0.3: C30.2 130.27,70.19 C18.2 130.68,68.13 CARD1.4 ; C63.2 78.69,35.34 78.36,35.01 76.42,35.01 76.1,34.69 U8.8 ; D34.2 74.22,29.87 74.36,30.01 ; 54.53,29.42 54.51,29.41 54.51,27.63 ; D28.2 64.56,28.21 D29.2
  Top Layer w0.4: v1(116.62,79.08) 117.13,79.08
  Bottom Layer w0.2: 110.78,35.17 111.51,35.17 v1(111.54,35.14) ; 114.82,14.66 114.82,16.53
  Bottom Layer w0.4: v1(116.62,79.08) 110.78,73.24 110.78,17.11 111.98,15.9 114.06,15.9 114.75,16.6 115.9,15.45 127.67,15.45 128.07,15.05 128.07,14.66
+3.7V: length 82.7
  Top Layer w0.254: 36.27,51.86 37.22,50.91 CN3.2 ; 36.27,51.86 36.1,52.03 ; 36.27,51.86 39.44,51.86 R11.1 ; LED8.2 4.57,56.75 4.55,56.73 ; R5.2 2.69,56.09 3.33,56.73 4.55,56.73 ; CN3.4 36.72,50.65 35.85,51.52 35.85,52.41 ; L1.2 11.59,53.9 11.59,56.35 11.21,56.73 4.55,56.73 ; 33.66,52.41 33.81,52.26 33.81,40.22 33.42,39.83 R10.1
  Top Layer w0.3: 19.72,52.41 19.72,52.41 CN3.72 ; CN3.70 20.22,52.34 20.29,52.41 ; 19.32,52.41 19.22,52.31 CN3.74
  Top Layer w1.5: L1.2 11.6,50.2 C6.2 C7.2
  Top Layer w2.5: 11.84,52.16 12.1,52.41 35.85,52.41
+5V: length 3.4
  Top Layer w0.6: C70.2 81.57,27.96 81.57,29.13 R130.1 82.05,29.62 U25.5
+24V: length 31.1
  Top Layer w0.254: C40.2 10.6,41.62 C2.2 ; C38.1 9.63,34.63 5.98,34.63 R59.2 ; 11.91,30.2 11.92,30.19 16.41,30.19 16.96,29.64 D44.2
  Top Layer w0.8: U3.8 7.78,41.9 C3.2 C2.2
  Top Layer w1: Q2.2 11.91,30.5 10.45,31.96 10.45,34.83 C38.1 10.47,35.47 C2.2
GND: length 11.1
  Top Layer w0.178: U21.3 U21.8 v1(119.28,32.85) ; v1(122.85,32.85) 122.84,32.84 U20.8 U20.3
  Top Layer w0.254: U3.4 1.19,48.2 R81.1
  Top Layer w0.3: v1(31.78,71.33) U33.3 U33.8 ; U8.3 76.1,37.48 v1(76.6,36.97) 77.1,37.47 U8.1
  vias: v1(1.95,45.93) v1(7.17,47.15) v1(7.93,43.72) v1(8.3,38.31) v1(9.53,46.11) v1(10.47,43.72) v1(11.86,47.15) v1(11.86,44.94) v1(15.02,58.13) v1(15.27,78.83) v1(17.94,27.65) v1(19.21,36.54) v1(19.46,43.52) v1(23.53,43.52) v1(24.16,29.55) v1(27.84,78.83) v1(27.97,43.52) v1(28.96,29.55) v1(29.24,56.35) v1(29.46,43.52) v1(31.02,43.52) v1(33.81,29.55) v1(35.08,43.27) v1(36.99,43.27) v1(38.64,29.55) v1(39.66,42.63) v1(40.04,38.57) v1(42.58,22.19) v1(43.72,46.32) v1(49.69,21.57) v1(49.69,20.03) v1(50.25,28.27) v1(56.04,25.74) v1(56.67,31.33) v1(57.29,21.3) v1(58.71,22.19) v1(60.1,28.15) v1(60.64,73.58) v1(62.29,78.29) v1(63.47,69.9) v1(64.95,69.9) v1(65.95,25.87) v1(66.06,45.07) v1(67.21,21.3) v1(68.24,76.73) v1(68.54,22.23) v1(69.11,51.03) v1(69.12,35.14) v1(69.46,76.73) v1(70.02,28.12) v1(70.67,76.73) v1(75.86,26.02) v1(76.95,21.29) v1(78.39,22.19) v1(78.64,38.56) v1(79.41,59.27) v1(79.91,31.45) v1(79.91,28.28) v1(80.42,64.86) v1(80.55,78.45) v1(80.55,76.92) v1(80.55,75.4) v1(80.55,71.72) v1(80.55,66.38) v1(80.55,61.17) v1(81.09,81.08) v1(81.47,86.67) v1(83.98,27.9) v1(85.25,30.57) v1(89.69,29.04) v1(127.92,70.19) v1(128.43,65.49)
(no net):
  vias: v1(10.22,59.56) v1(13.56,47.94) v1(13.62,55.71) v1(15.14,56.73) v1(15.14,46.95) v1(16.8,42.63) v1(16.92,55.59) v1(16.92,47.97) v1(18.63,55.61) v1(20.28,55.61) v1(21.93,55.61) v1(24.8,56.48) v1(26.57,57.75) v1(28.96,75.8) v1(31.15,55.59) v1(32.54,76.8) v1(32.79,55.59) v1(33.11,64.97) v1(34.47,55.59) v1(35,76.8) v1(36.1,55.59) v1(36.48,64.98) v1(39.66,64.98)
485-A: length 11.7
  Top Layer w0.3: 45.87,20.03 46.06,19.84 47.44,19.84 47.53,19.75 47.53,18.5 48.55,17.49 50.45,17.49 ; 45.87,20.03 R112.1 ; 45.87,20.03 44.35,20.03 43.85,20.53 U23.6
485-B: length 12.8
  Top Layer w0.3: 52.99,17.49 52.99,18.12 51.85,19.26 49.31,19.26 48.55,20.03 48.55,21.3 48.16,21.68 47.51,21.68 47.44,21.74 46.08,21.74 R112.2 45.38,21.54 45.12,21.8 U23.7
ANALOG-OUT0: length 11.1
  Top Layer w0.254: 71.9,31.45 71.1,31.45 C60.1 ; 71.9,31.45 71.91,31.46 v1(71.91,31.96) ; 71.9,31.45 R110.2 72.93,31.7 U22.14 ; v1(74.83,35.65) 75.1,35.39 U8.6
  Bottom Layer w0.254: v1(71.91,31.96) 71.91,32.73 v1(74.83,35.65)
ANALOG-OUT1: length 20
  Top Layer w0.254: C58.1 62.76,31.08 R103.2 62.77,31.97 64.31,33.51 U22.8 65.31,34.63 67.09,36.41 74.96,36.41 75.6,35.78 U8.7
ANALOG-OUT2: length 30.2
  Top Layer w0.254: C54.1 51.16,31.19 R89.2 53.36,31.19 55.53,33.36 61.11,33.36 65.05,37.29 v1(65.05,37.42) 65.3,37.68 65.3,39.04 U22.7 ; U8.4 75.6,37.42 75.34,37.17 v1(68.36,37.17)
  Bottom Layer w0.254: v1(68.36,37.17) 68.11,37.42 v1(65.05,37.42)
C0-: length 7.9
  Top Layer w0.4: 75.85,17.49 75.85,17.87 73.56,20.15 73.56,23.42 R105.1
C1-: length 10
  Top Layer w0.4: R98.1 63.79,23.27 63.79,20.53 65.31,19.01 67.34,19.01 68.23,18.12 68.23,17.49
C2-: length 12
  Top Layer w0.4: 60.61,17.49 59.09,19.01 57.56,19.01 56.8,19.77 54.51,19.77 53.75,20.53 53.75,23.63 53.16,24.22
CAM1_C_N: length 35.5
  Top Layer w0.127: 93.6,98.55 93.6,80.9 arc(93.66,80.75) 93.81,80.69 arc(93.95,80.63) 94.01,80.49 94.01,79.37 arc(93.95,79.23) 93.81,79.17 arc(93.66,79.11) 93.6,78.96 93.6,77.85 arc(93.66,77.71) 93.81,77.65 arc(93.95,77.59) 94.01,77.44 94.01,76.33 arc(93.95,76.18) 93.81,76.12 arc(93.66,76.06) 93.6,75.92 93.6,74.8 arc(93.66,74.66) 93.81,74.6 arc(93.95,74.54) 94.01,74.39 94.01,73.28 arc(93.95,73.13) 93.81,73.07 arc(93.66,73.01) 93.6,72.87 93.6,72.58 88.74,67.71 U46.127
CAM1_C_P: length 35.4
  Top Layer w0.127: 93.1,100.5 93.1,72.58 88.63,68.11 U46.129
CAM1_D0_N: length 39.2
  Top Layer w0.127: U46.115 88.88,65.31 96.6,73.04 96.6,91.49 arc(96.69,91.7) 96.89,91.79 arc(97.1,91.87) 97.19,92.08 97.19,93.02 arc(97.1,93.22) 96.89,93.31 arc(96.69,93.39) 96.6,93.6 96.6,94.54 arc(96.69,94.75) 96.89,94.83 arc(97.1,94.92) 97.19,95.13 97.19,96.07 arc(97.1,96.27) 96.89,96.36 arc(96.69,96.44) 96.6,96.65 96.6,98.55
CAM1_D0_P: length 39.1
  Top Layer w0.127: U46.117 88.77,65.71 96.1,73.04 96.1,100.5
CAM1_D1_N: length 37.9
  Top Layer w0.127: 95.1,100.5 95.1,72.81 88.81,66.51 U46.121
CAM1_D1_P: length 38
  Top Layer w0.127: U46.123 88.7,66.91 94.6,72.81 94.6,82.51 arc(94.53,82.68) 94.37,82.74 arc(94.21,82.81) 94.14,82.98 94.14,84.04 arc(94.21,84.2) 94.37,84.27 arc(94.53,84.34) 94.6,84.5 94.6,85.56 arc(94.53,85.72) 94.37,85.79 arc(94.21,85.86) 94.14,86.02 94.14,87.08 arc(94.21,87.25) 94.37,87.32 arc(94.53,87.38) 94.6,87.55 94.6,88.61 arc(94.53,88.77) 94.37,88.84 arc(94.21,88.91) 94.14,89.07 94.14,90.13 arc(94.21,90.3) 94.37,90.36 arc(94.53,90.43) 94.6,90.6 94.6,91.66 arc(94.53,91.82) 94.37,91.89 arc(94.21,91.96) 94.14,92.12 94.14,93.18 arc(94.21,93.34) 94.37,93.41 arc(94.53,93.48) 94.6,93.64 94.6,94.7 arc(94.53,94.87) 94.37,94.94 arc(94.21,95) 94.14,95.17 94.14,96.23 arc(94.21,96.39) 94.37,96.46 arc(94.53,96.53) 94.6,96.69 94.6,98.55
CAM1_D2_N: length 34.5
  Top Layer w0.127: U46.133 88.67,68.91 92.1,72.35 92.1,94.91 arc(92.14,95) 92.23,95.04 arc(92.32,95.08) 92.36,95.17 92.36,96.44 arc(92.32,96.53) 92.23,96.57 arc(92.14,96.6) 92.1,96.69 92.1,100.5
CAM1_D2_P: length 34.5
  Top Layer w0.127: U46.135 88.56,69.31 91.6,72.35 91.6,82.51 arc(91.53,82.69) 91.35,82.77 arc(91.17,82.84) 91.09,83.02 91.09,84.03 arc(91.17,84.22) 91.35,84.29 arc(91.53,84.37) 91.6,84.55 91.6,85.56 arc(91.53,85.74) 91.35,85.81 arc(91.17,85.89) 91.09,86.07 91.09,87.08 arc(91.17,87.26) 91.35,87.34 arc(91.53,87.41) 91.6,87.59 91.6,88.61 arc(91.53,88.79) 91.35,88.86 arc(91.17,88.94) 91.09,89.12 91.09,90.13 arc(91.17,90.31) 91.35,90.39 arc(91.53,90.46) 91.6,90.64 91.6,91.65 arc(91.53,91.84) 91.35,91.91 arc(91.17,91.99) 91.09,92.17 91.09,93.18 arc(91.17,93.36) 91.35,93.43 arc(91.53,93.51) 91.6,93.69 91.6,94.7 arc(91.53,94.88) 91.35,94.96 arc(91.17,95.03) 91.09,95.21 91.09,96.23 arc(91.17,96.41) 91.35,96.48 arc(91.53,96.56) 91.6,96.74 91.6,98.55
CAM1_D3_N: length 31.6
  Top Layer w0.127: 90.6,98.55 90.6,82.34 arc(90.66,82.21) 90.78,82.15 arc(90.91,82.1) 90.96,81.97 90.96,80.81 arc(90.91,80.68) 90.78,80.63 arc(90.66,80.58) 90.6,80.45 90.6,79.29 arc(90.66,79.16) 90.78,79.11 arc(90.91,79.05) 90.96,78.93 90.96,77.76 arc(90.91,77.64) 90.78,77.58 arc(90.66,77.53) 90.6,77.4 90.6,76.24 arc(90.66,76.11) 90.78,76.06 arc(90.91,76.01) 90.96,75.88 90.96,74.72 arc(90.91,74.59) 90.78,74.53 arc(90.66,74.48) 90.6,74.35 90.6,72.24 88.47,70.11 U46.139
CAM1_D3_P: length 31.6
  Top Layer w0.127: 90.1,100.5 90.1,72.25 88.36,70.51 U46.141
ETH_LEDG: length 35.9
  Top Layer w0.178: 121.39,65.31 121.88,65.31 122.97,64.22 124.36,64.22 125,63.59 125,54.06 127.03,52.03 R74.2
ETH_LEDY: length 37
  Top Layer w0.178: 121.39,65.71 121.98,65.71 123.09,64.6 124.49,64.6 125.38,63.71 125.38,54.08 127.31,52.15 127.31,34.58 128.56,33.34 R75.2
ETH_P0_N: length 42.7
  Top Layer w0.178: 118.31,64.11 117.87,64.11 117.85,64.14 116.66,64.14 115.73,63.21 115.73,56.23 arc(115.84,55.96) 116.11,55.85 arc(116.38,55.74) 116.49,55.47 116.49,54.71 arc(116.38,54.44) 116.11,54.33 arc(115.84,54.22) 115.73,53.95 115.73,53.19 arc(115.84,52.92) 116.11,52.8 arc(116.38,52.69) 116.49,52.42 116.49,51.66 arc(116.38,51.39) 116.11,51.28 arc(115.84,51.17) 115.73,50.9 115.73,50.14 arc(115.84,49.87) 116.11,49.76 arc(116.38,49.64) 116.49,49.38 116.49,48.61 arc(116.38,48.34) 116.11,48.23 arc(115.84,48.12) 115.73,47.85 115.73,47.09 arc(115.84,46.82) 116.11,46.71 arc(116.38,46.6) 116.49,46.33 116.49,45.57 arc(116.38,45.3) 116.11,45.18 arc(115.84,45.07) 115.73,44.8 115.73,43.64 118.71,40.66 118.71,32.47 118.79,32.4 U21.9 U21.2 118.79,28.97 118.26,28.45
ETH_P0_P: length 42.7
  Top Layer w0.178: 118.31,64.51 117.87,64.51 117.85,64.49 116.51,64.49 115.37,63.35 115.37,43.5 118.36,40.51 118.36,32.47 118.28,32.4 U21.10 U21.1 118.28,30.2 116.89,28.81 116.89,25.91
ETH_P1_N: length 39.7
  Top Layer w0.178: 123.34,28.45 123.34,29.05 122.34,30.05 U20.2 U20.9 122.34,32.34 122.18,32.5 122.18,34.02 120.3,35.9 120.3,40.86 117.63,43.52 117.63,47.59 119.51,49.47 119.51,50.08 arc(119.61,50.32) 119.84,50.41 arc(120.08,50.51) 120.17,50.74 120.17,51.61 arc(120.08,51.84) 119.84,51.94 arc(119.61,52.03) 119.51,52.27 119.51,62.79 119.01,63.29 118.77,63.29 118.75,63.31 118.31,63.31
ETH_P1_P: length 39.8
  Top Layer w0.178: 118.31,62.91 118.75,62.91 118.77,62.94 118.86,62.94 119.16,62.64 119.16,49.62 117.28,47.74 117.28,43.38 119.94,40.71 119.94,32.62 119.79,32.46 U21.7 U21.4 119.79,29.8 119.41,29.42 119.41,25.93 119.43,25.91
ETH_P2_N: length 40.5
  Top Layer w0.178: 121.39,64.11 120.7,64.11 120.55,63.97 120.55,53.04 122.38,51.21 122.38,36.12 122.59,35.91 v1(122.59,35.01) ; 121.97,25.91 121.97,30.16 121.82,30.31 121.82,31.16 U20.1 U20.10 121.84,33.13 v1(121.5,33.47)
  Bottom Layer w0.178: v1(121.5,33.47) 121.5,33.92 v1(122.59,35.01)
ETH_P2_P: length 40.4
  Top Layer w0.178: v1(121.82,35.52) 121.82,35.91 122.03,36.12 122.03,42.05 arc(121.96,42.21) 121.8,42.28 arc(121.64,42.35) 121.57,42.51 121.57,43.58 arc(121.64,43.74) 121.8,43.8 arc(121.96,43.87) 122.03,44.03 122.03,45.1 arc(121.96,45.26) 121.8,45.33 arc(121.64,45.4) 121.57,45.56 121.57,46.62 arc(121.64,46.79) 121.8,46.85 arc(121.96,46.92) 122.03,47.08 122.03,48.15 arc(121.96,48.31) 121.8,48.38 arc(121.64,48.44) 121.57,48.6 121.57,49.67 arc(121.64,49.83) 121.8,49.9 arc(121.96,49.97) 122.03,50.13 122.03,51.07 120.2,52.89 120.2,64.12 120.6,64.51 121.39,64.51 ; v1(120.96,34.01) 120.28,33.34 U21.6 U21.5 120.28,28.96 120.8,28.45
  Bottom Layer w0.178: v1(120.96,34.01) 122.01,35.06 122.01,35.34 v1(121.82,35.52)
ETH_P3_N: length 38.8
  Top Layer w0.178: 121.39,63.31 122.35,63.31 122.84,62.82 122.84,53.68 123.84,52.68 123.84,48.85 arc(123.94,48.62) 124.17,48.53 arc(124.4,48.43) 124.49,48.2 124.49,47.33 arc(124.4,47.1) 124.17,47 arc(123.94,46.91) 123.84,46.68 123.84,45.8 arc(123.94,45.57) 124.17,45.48 arc(124.4,45.38) 124.49,45.15 124.49,44.28 arc(124.4,44.05) 124.17,43.95 arc(123.94,43.86) 123.84,43.63 U20.6 U20.5 123.84,30.49 125.88,28.45
ETH_P3_P: length 38.9
  Top Layer w0.178: 121.39,62.91 122.24,62.91 122.48,62.68 122.48,53.53 123.48,52.53 123.48,32.48 123.34,32.34 U20.7 U20.4 123.34,30.32 124.49,29.17 124.49,25.93 124.51,25.91
GMS_PWR: length 2.3
  Top Layer w0.254: U3.3 3.23,48.46 2.71,48.98 2.71,49.56
GSM_COEX_RX: length 3
  Top Layer w0.178: v1(23.02,47.71) 22.22,48.51 CN3.62
  Bottom Layer w0.178: v1(23.02,47.71) 23.27,47.46 TP5.1
GSM_COEX_TX: length 2.9
  Top Layer w0.178: v1(20.99,47.71) 21.72,48.45 CN3.64
  Bottom Layer w0.178: v1(20.99,47.71) TP6.1
GSM_OFF: length 6.5
  Top Layer w0.254: R11.2 40.42,49.12 40.42,48.22 40.29,48.09 36.35,48.09 36.22,48.23 CN3.6
HDMI0_CEC: length 16
  Top Layer w0.178: v1(89.31,72.48) 87.51,72.48 U46.151
  Bottom Layer w0.178: v1(103.41,72.48) v1(89.31,72.48)
HDMI0_CLK_N: length 20.1
  Top Layer w0.178: v1(85.71,80.29) 85.5,80.09 84.85,80.09 84.83,80.11 U46.190
  Bottom Layer w0.178: v1(85.71,80.29) 85.91,80.09 103.91,80.09 v1(104.17,80.35)
HDMI0_CLK_P: length 20.9
  Top Layer w0.178: U46.188 84.83,79.71 84.85,79.74 85.5,79.74 v1(85.71,79.53)
  Bottom Layer w0.178: v1(85.71,79.53) 85.91,79.74 104.89,79.74 105.07,79.91 v1(105.07,79.92)
HDMI0_HOTPLUG: length 13.1
  Top Layer w0.178: U46.153 88.86,72.91 v1(89.31,73.37)
  Bottom Layer w0.178: v1(89.31,73.37) 89.57,73.11 v1(100.23,73.11)
HDMI0_SCL: length 18
  Top Layer w0.178: U46.200 v1(85.63,82.11)
  Bottom Layer w0.178: v1(85.63,82.11) 86.03,82.51 v1(102.27,82.51)
HDMI0_SDA: length 14.3
  Top Layer w0.178: U46.199 88.44,82.11 v1(88.68,81.88)
  Bottom Layer w0.178: v1(101.63,81.88) v1(88.68,81.88)
HDMI0_TX0_N: length 21.8
  Top Layer w0.178: U46.184 84.83,78.91 84.85,78.89 86.39,78.89 v1(86.6,79.09)
  Bottom Layer w0.178: v1(86.6,79.09) 86.8,78.89 105.38,78.89 v1(105.82,79.34)
HDMI0_TX0_P: length 22.9
  Top Layer w0.178: U46.182 84.83,78.51 84.85,78.54 86.39,78.54 v1(86.6,78.33) ; v1(106.57,79.03) 106.37,78.83
  Bottom Layer w0.178: v1(106.57,79.03) 106.57,78.94 106.17,78.54 86.8,78.54 v1(86.6,78.33)
HDMI0_TX1_N: length 23.2
  Top Layer w0.178: v1(85.45,77.89) 85.25,77.69 84.85,77.69 84.83,77.71 U46.178
  Bottom Layer w0.178: v1(85.45,77.89) 85.66,77.69 107.11,77.69 v1(107.31,77.89)
HDMI0_TX1_P: length 24.2
  Top Layer w0.178: U46.176 84.83,77.31 84.85,77.34 85.25,77.34 v1(85.45,77.13)
  Bottom Layer w0.178: v1(108.07,77.89) 108.07,77.77 107.63,77.34 85.66,77.34 v1(85.45,77.13)
HDMI0_TX2_N: length 24.8
  Top Layer w0.178: U46.172 84.83,76.51 84.85,76.49 86.39,76.49 v1(86.6,76.69)
  Bottom Layer w0.178: v1(86.6,76.69) 86.99,76.69 87.19,76.49 108.57,76.49 v1(108.87,76.8)
HDMI0_TX2_P: length 25.5
  Top Layer w0.178: v1(86.6,75.93) 86.39,76.14 84.85,76.14 84.83,76.11 U46.170
  Bottom Layer w0.178: v1(109.63,76.41) 109.35,76.14 87.19,76.14 86.99,75.93 v1(86.6,75.93)
HUB_3.3V: length 19.6
  Top Layer w0.254: 73.93,51.52 74.45,51.52 75.02,50.95 U10.21 ; 73.93,51.52 72.04,51.52 71.85,51.33 U10.26 ; 73.93,51.52 73.95,51.54 73.95,53.81 74.06,53.93 R49.2 R48.2 R47.2 ; 80.8,46.82 75.84,46.82 75.08,47.58 ; C25.2 80.74,46.83 C23.2
IN0: length 1.7
  Top Layer w0.254: 21.62,30.95 21.63,30.95 21.63,32.6
IN0+: length 14.2
  Top Layer w0.3: 78.35,25.15 78.89,25.69 78.89,27.01
  Top Layer w0.4: D37.2 79.31,24.82 79.91,24.22 79.91,19.01 78.39,17.49 ; 78.35,25.15 77.8,24.6 76.24,24.6 R105.2
IN0-: length 7.1
  Top Layer w0.4: R107.2 71.14,21.73 D38.1 71.55,20.26 73.18,18.63 73.18,17.61 73.31,17.49
IN0-A: length 6.9
  Top Layer w0.254: CN7.8 21.38,14.95 21.38,20.92
IN0-C: length 12.8
  Top Layer w0.3: U6.2 24.48,24.03 24.48,22.44 ; 24.48,22.44 C47.2 ; 24.48,22.44 R70.1 ; CN7.7 24.28,14.35 24.28,18.88 25.42,20.02 25.42,21.8 24.92,22.31 24.53,22.31
IN1: length 1.9
  Top Layer w0.254: 26.45,30.95 26.2,31.19 R119.1
IN1+: length 13.8
  Top Layer w0.3: R99.2 68.96,25.3 D31.2 69.53,24.82 70.01,24.34 70.01,18.25 70.77,17.49
  Top Layer w0.4: D31.2 67.79,24.13 R98.2
IN1-: length 8
  Top Layer w0.4: 65.69,17.49 65.6,17.49 D32.1 61.22,21.86 R100.2
IN1-A: length 7.2
  Top Layer w0.3: CN7.6 27.74,18.72 26.33,20.13 R114.1
IN1-C: length 13.1
  Top Layer w0.3: 29.5,22.44 30.12,22.44 30.38,22.18 30.38,18.75 31.24,17.89 CN7.5 ; 29.5,22.44 29.49,22.38 ; 29.5,22.44 29.29,22.64 29.29,24.05 U15.2 ; 29.5,22.44 C48.2 29.49,22.38 ; 29.49,22.38 27.9,22.38 27.84,22.44
IN2: length 1.9
  Top Layer w0.254: 31.03,32.73 31.03,31.19 31.27,30.95
IN2+: length 14.6
  Top Layer w0.4: D5.2 60.23,23.3 60.23,19.65 60.86,19.01 62.01,19.01 63.15,17.87 63.15,17.49 ; D5.2 59.08,25.19 59.08,26.63 ; D5.2 58.1,24.22 56.12,24.22
IN2-: length 10.4
  Top Layer w0.4: 58.07,17.49 56.55,19.01 54.04,19.01 D6.1 51.47,21.58 R86.2
IN2-A: length 8.1
  Top Layer w0.3: R115.1 31.16,19.88 34.69,16.34 34.69,14.35 CN7.4
IN2-C: length 13.8
  Top Layer w0.3: U16.2 34.11,24.05 34.11,22.64 34.32,22.44 ; CN7.3 38.24,15.34 35.2,18.37 35.2,21.93 34.69,22.44 34.32,22.44 ; 34.32,22.44 C49.2 34.26,22.44 R72.1
IN3: length 1.9
  Top Layer w0.254: R117.1 35.85,31.19 36.1,30.95
IN3-A: length 9.1
  Top Layer w0.3: CN7.2 41.43,14.31 35.99,19.74 R116.1
IN3-C: length 15
  Top Layer w0.3: 39.15,22.44 38.94,22.64 38.94,24.05 U17.2 ; 39.15,22.44 39.14,22.44 ; 39.15,22.44 C50.2 39.09,22.44 37.49,22.44 ; 39.15,22.44 39.9,22.44 40.16,22.18 40.16,19.39 CN7.1
LED_STATUS: length 29.9
  Top Layer w0.178: 118.31,66.91 115.88,66.91 111.54,62.57 R172.1
NRPIBOOT: length 9.2
  Top Layer w0.254: 121.39,80.91 125.03,80.91 126.1,79.84 129.98,79.84 130.11,79.97
PCIE_CLK_REQ: length 11.4
  Top Layer w0.213: U46.102 83.66,62.51 83.09,63.08 78.9,63.08 75.82,66.15 CN5.52
PCIE_CLP_N: length 3.3
  Top Layer w0.216: CN5.53 82.1,65.87 83.34,65.87 83.72,65.49 83.72,64.73 83.94,64.51 U46.112
PCIE_CLP_P: length 3.3
  Top Layer w0.216: CN5.55 83.05,65.4 83.33,65.12 83.33,64.36 83.58,64.11 U46.110
PCIE_R0_N: length 8.7
  Top Layer w0.216: CN5.41 82.95,68.9 83,68.85 83.27,68.85 v1(83.47,69.05) ; v1(86.21,65.82) 86.15,65.87 85.01,65.87 84.85,65.71 U46.118
  Bottom Layer w0.216: v1(83.47,69.05) 83.67,68.85 85.24,68.85 86.02,68.07 86.02,66 v1(86.21,65.82)
PCIE_R0_P: length 7.8
  Top Layer w0.216: U46.116 85.43,65.31 v1(85.5,65.24) ; v1(83.47,68.29) 83.3,68.46 83,68.46 82.95,68.4 CN5.43
  Bottom Layer w0.216: v1(85.5,65.24) 85.63,65.37 85.63,67.91 85.08,68.46 83.64,68.46 v1(83.47,68.29)
PCIE_RST: length 14.3
  Top Layer w0.213: v1(79.15,63.97) 76.47,66.65 CN5.50 ; U46.109 87.02,64.11 86.78,64.35 v1(86.01,64.35)
  Bottom Layer w0.213: v1(79.15,63.97) 85.63,63.97 v1(86.01,64.35)
